# Altium schematic sheet ISOSPI.SchDoc
size A4; SheetNumber: 6; SheetTotal: 11
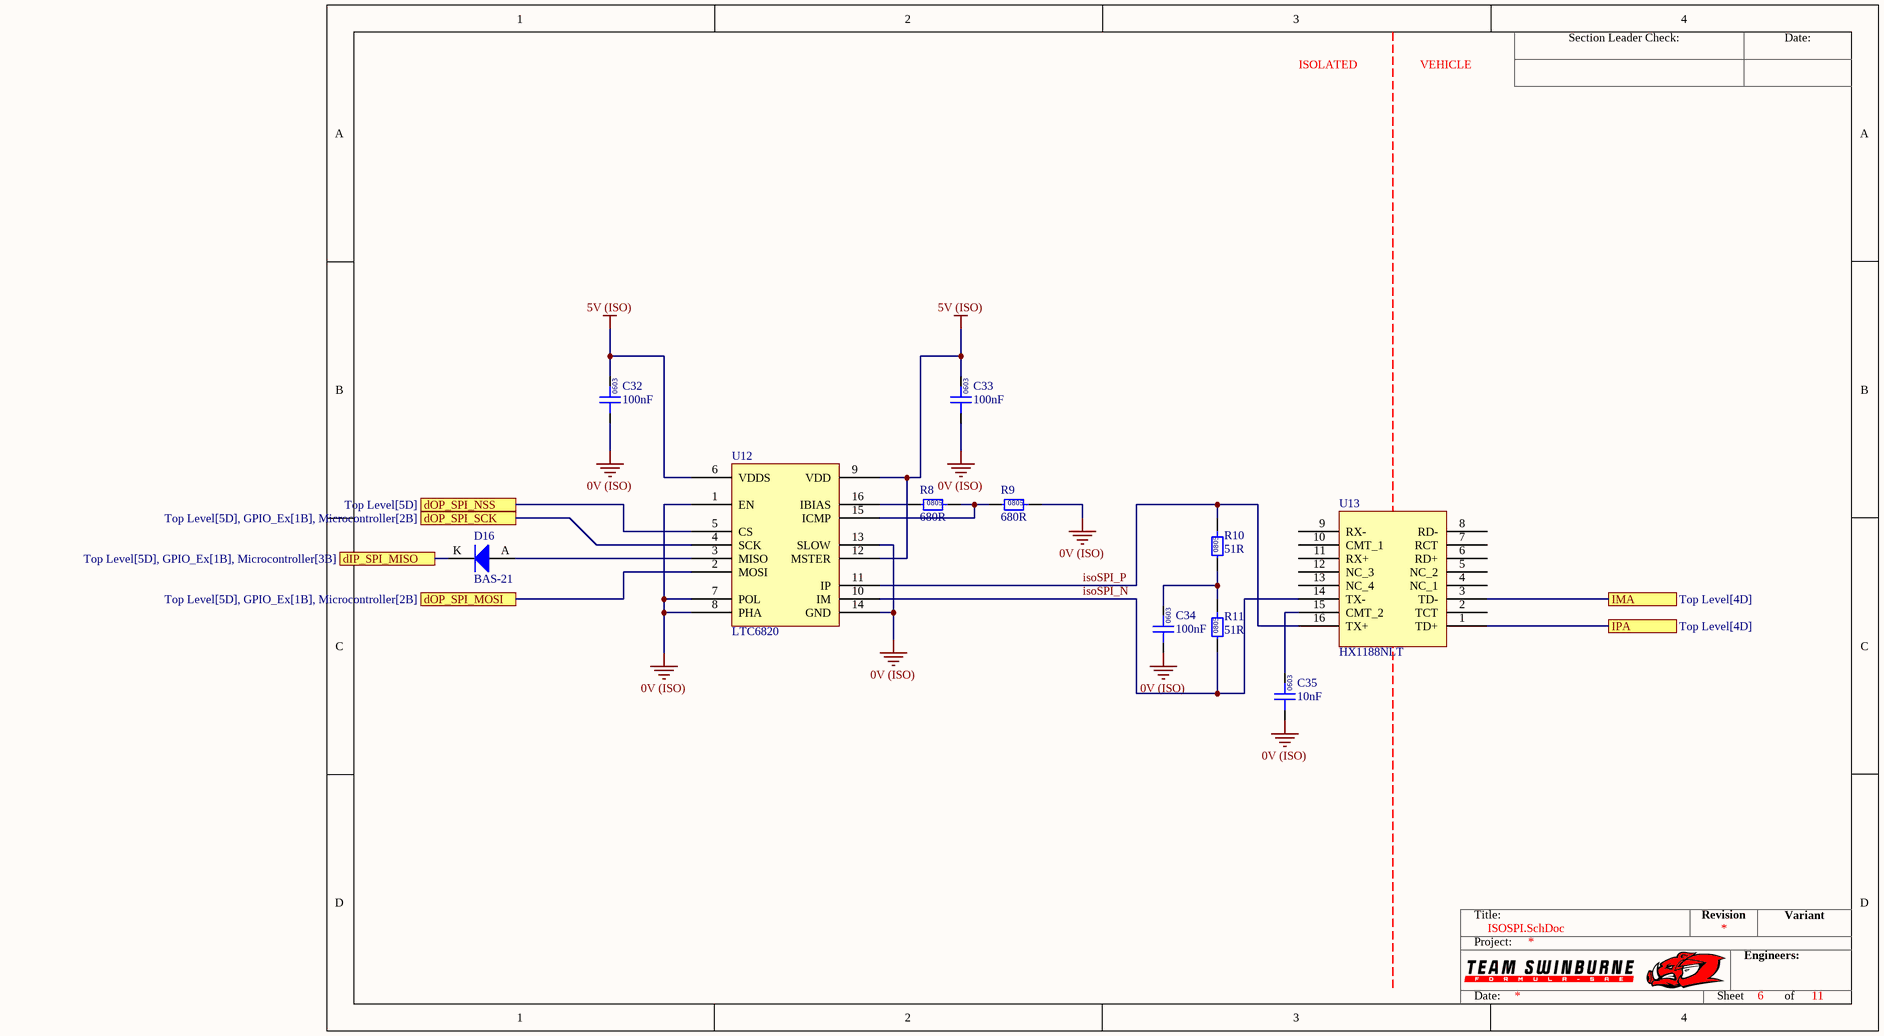
[diagram p0: ISOSPI.SchDoc]

## Parts
C32  100nF  [0603]
C33  100nF  [0603]
C34  100nF  [0603]
C35  10nF  [0603]
D16  BAS-21  [NEXPERIA_SOT23]
R8  680R  [0805]
R9  680R  [0805]
R10  51R  [0805]
R11  51R  [0805]
U12  LTC6820  [WFQN-16]
U13  HX1188NLT  [HX1188NL]

## Ports
dIP_SPI_MISO (see Top Level[5D], GPIO_Ex[1B], Microcontroller[3B]), dOP_SPI_MOSI (see Top Level[5D], GPIO_Ex[1B], Microcontroller[2B]), dOP_SPI_NSS (see Top Level[5D]), dOP_SPI_SCK (see Top Level[5D], GPIO_Ex[1B], Microcontroller[2B]), IMA (see Top Level[4D]), IPA (see Top Level[4D])

## Nets
0V (ISO): C32.1 C33.1 C34.1 C35.1 R9.2 U12.1(EN) U12.7(POL) U12.8(PHA) U12.13(SLOW) U12.14(GND)
5V (ISO): C32.2 C33.2 U12.6(VDDS) U12.9(VDD) U12.12(MSTER)
dIP_SPI_MISO: D16.K ; port dIP_SPI_MISO
dOP_SPI_MOSI: U12.2(MOSI) ; port dOP_SPI_MOSI
dOP_SPI_NSS: U12.5(CS) ; port dOP_SPI_NSS
dOP_SPI_SCK: U12.4(SCK) ; port dOP_SPI_SCK
IMA: U13.3(TD-) ; port IMA
IPA: U13.1(TD+) ; port IPA
isoSPI_N: R11.1 U12.10(IM) U13.14(TX-)
isoSPI_P: R10.2 U12.11(IP) U13.16(TX+)
NetC34_2: C34.2 R10.1 R11.2
NetC35_2: C35.2 U13.15(CMT_2)
NetD16_A: D16.A U12.3(MISO)
NetR8_1: R8.1 U12.16(IBIAS)
NetR8_2: R8.2 R9.1 U12.15(ICMP)

Not connected (* = marked no-connect by the designer): U13 2(TCT) 4(NC_1) 5(NC_2) 6(RD+) 7(RCT) 8(RD-) 9(RX-) 10(CMT_1) 11(RX+) 12(NC_3) 13(NC_4)

## Notes on the sheet
- ISOLATED
- VEHICLE
- Section Leader Check:
- Date:
- Title:
- Revision
- Variant
- Project:
- Engineers:
- Sheet
- of
- (in symbol GCM188L81H103KA03D) 0603
- (in symbol GCM188L81H104KA57D) 0603
- (in symbol RC0805FR0751RL) 0805
- (in symbol RC0805FR07680RL) 0805

## Library data of the parts
C32-C34 = GCM188L81H104KA57D: Manufacturer: muRata; Rated Voltage: 50V; Tolerance: ±10%; Material: MLCC; Temperature Rating: X8L; Part Number: GCM188L81H104KA57D; Value: 100nF; Digikey Part Number: 490-6049-1-ND
C35 = GCM188L81H103KA03D: Manufacturer: muRata; Rated Voltage: 50V; Tolerance: ±10%; Material: MLCC; Temperature Rating: X8L; Part Number: GCM188L81H103KA03D; Value: 10nF; Digikey Part Number: 490-GCM188L81H103KA03DCT-ND
D16 = BAS-21: Manufacturer: Nexperia USA Inc.; Forward Voltage: 1.0V; Breakdown Voltage: 250V; Rated Power: 250mW; Part Number: BAS-21
R8 R9 = RC0805FR07680RL: Manufacturer: YAGEO; Tolerance: 0.01; Rated Power: 0.125W; Part Number: RC0805FR07680RL; Value: 680R; Material: FR-07; Digikey Part Number: 311-680CRCT-ND
R10 R11 = RC0805FR0751RL: Manufacturer: YAGEO; Tolerance: 0.01; Rated Power: 0.125W; Part Number: RC0805FR0751RL; Value: 51R; Material: FR-07; Digikey Part Number: 311-51.0CRCT-ND
U12 = LTC6820: isoSPI Transceiver; Manufacturer: Analogue Devices; Part Number: LTC6820
U13 = HX1188NL: MODULE XFRMR SGL ETHR LAN 16SOIC; Manufacturer: Analogue Devices; Part Number: HX1188NL